# EAGLE schematic figro (EAGLE 7.2.0)
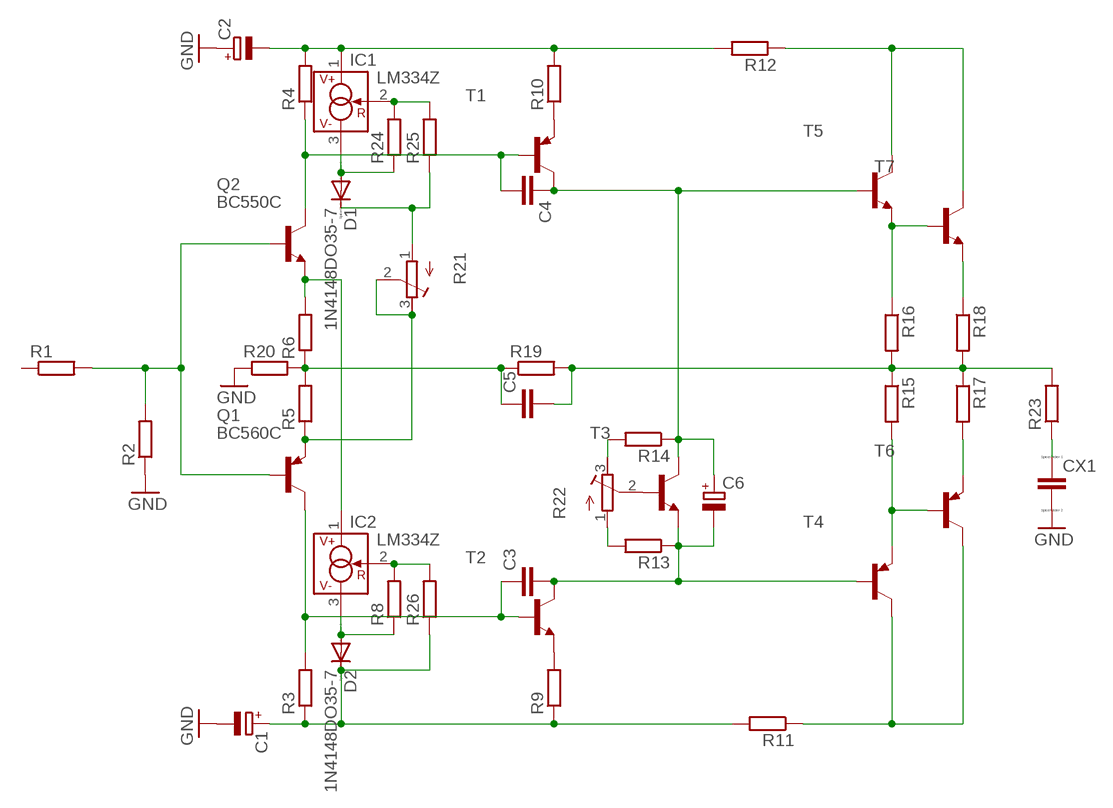
[diagram p0: schematic, sheet 1]

## Parts
C1  CPOL-EUE7.5-18  [E7,5-18]
C2  CPOL-EUE7.5-18  [E7,5-18]
C3  C-EU050-030X075  [C050-030X075]
C4  C-EU050-030X075  [C050-030X075]
C5  C-EU050-030X075  [C050-030X075]
C6  CPOL-EUE2.5-7  [E2,5-7]
CX1  CXXC15B6  [XC15B6]
D1  1N4148DO35-7  [DO35-7]
D2  1N4148DO35-7  [DO35-7]
IC1  LM334Z  [TO92]
IC2  LM334Z  [TO92]
Q1  BC560C  [TO92-EBC]
Q2  BC550C  [TO92-EBC]
R1  R-EU_0207/10  [0207/10]
R2  R-EU_0207/10  [0207/10]
R3  R-EU_0207/10  [0207/10]
R4  R-EU_0207/10  [0207/10]
R5  R-EU_0207/10  [0207/10]
R6  R-EU_0207/10  [0207/10]
R8  R-EU_0207/10  [0207/10]
R9  R-EU_0207/10  [0207/10]
R10  R-EU_0207/10  [0207/10]
R11  R-EU_0207/10  [0207/10]
R12  R-EU_0207/10  [0207/10]
R13  R-EU_0207/10  [0207/10]
R14  R-EU_0207/10  [0207/10]
R15  R-EU_0207/10  [0207/10]
R16  R-EU_0207/10  [0207/10]
R17  R-EU_0309/12  [0309/12]
R18  R-EU_0309/12  [0309/12]
R19  R-EU_0207/10  [0207/10]
R20  R-EU_0207/10  [0207/10]
R21  R-TRIMM64W  [RTRIM64W]
R22  R-TRIMM64W  [RTRIM64W]
R23  R-EU_0309/12  [0309/12]
R24  R-EU_0207/10  [0207/10]
R25  R-EU_0207/10  [0207/10]
R26  R-EU_0207/10  [0207/10]
T1  MPSA56-PNP-TO92-BCE  [TO92-BCE]
T2  MPSA06-NPN-TO92-EBC  [TO92-EBC]
T3  -NPN-TO126V  [TO126V]
T4  -PNP-TO220V  [TO220V]
T5  -NPN-TO220V  [TO220V]
T6  -PNP-TOP3V  [TOP3V]
T7  -NPN-TOP3V  [TOP3V]

## Nets
GND: C1.- C2.+ CX1.2 R2.1 R20.1
N$1: C5.1 R5.2 R6.1 R19.1 R20.2
N$2: Q1.B Q2.B R1.2 R2.2
N$3: C5.2 R15.1 R16.2 R17.1 R18.2 R19.2 R23.2
N$4: R11.1 T4.2(C) T6.C
N$5: IC2.1(V+) Q2.E R6.2
N$7: C2.- IC1.1(V+) R4.2 R10.2 R12.2
N$8: Q1.E R5.1 R21.2(S) R21.3(E)
N$9: C4.2 Q2.C R4.1 T1.B
N$10: C3.1 Q1.C R3.2 T2.B
N$11: R22.2(S) T3.3(B)
N$12: R10.1 T1.E
N$13: R9.2 T2.E
N$15: R14.2 R22.3(E)
N$16: R13.2 R22.1(A)
N$17: C3.2 C6.- R13.1 T2.C T3.1(E) T4.1(B)
N$18: C4.1 C6.+ R14.1 T1.C T3.2(C) T5.1(B)
N$19: R12.1 T5.2(C) T7.C
N$20: R16.1 T5.3(E) T7.B
N$21: R18.1 T7.E
N$22: R17.2 T6.E
N$23: R15.2 T4.3(E) T6.B
N$24: D1.A IC1.3(V-) R24.1
N$25: CX1.1 R23.1
N$26: IC1.2(R) R24.2 R25.2
N$27: D1.C R21.1(A) R25.1
N$28: D2.A IC2.3(V-) R8.1
N$29: IC2.2(R) R8.2 R26.2
N$30: C1.+ D2.C R3.1 R9.1 R11.2 R26.1
Unconnected: R1.1

## Library data of the parts
C1 C2 C6 = resistor:CPOL-EU: POLARIZED CAPACITOR, European symbol
C3-C5 = resistor:C-EU: CAPACITOR, European symbol
CX1 = resistor:CX: X CAPACITOR for power line
D1 D2 = diode:1N4148: DIODE high speed (Philips)
IC1 IC2 = linear:LM*34: 3-Terminal Adjustable Current Sources Source: www.national.com/pf/LM/LM334.html | LM134.pdf
Q1 = transistor-pnp:BC560*: PNP Transistror
Q2 = transistor-npn:BC550*: NPN Transistor
R1-R6 R8-R20 R23-R26 = resistor:R-EU_: RESISTOR, European symbol
R21 R22 = resistor:R-TRIMM: Trimm resistor
T1 = transistor:*-PNP-: PNP Transistror
T2 = transistor:*-NPN-: NPN Transistror BF959 corrected 2008.03.06
T3 T5 T7 = transistor-neu-to92:*-NPN-: NPN Transistror BF959 corrected 2008.03.06
T4 T6 = transistor-neu-to92:*-PNP-: PNP Transistror